# Altium schematic sheet RotationSensor.SchDoc
size Letter; CompanyName: Ploopy Corporation; Organization: Ploopy Corporation; Address1: Suite 226, 137-1140 Burnhamthorpe Road W; Address2: Mississauga; Address3: Ontario; Address4: Canada L5C 0A3; DocumentNumber: 7; Revision: R1.001; SheetNumber: 7; SheetTotal: 7
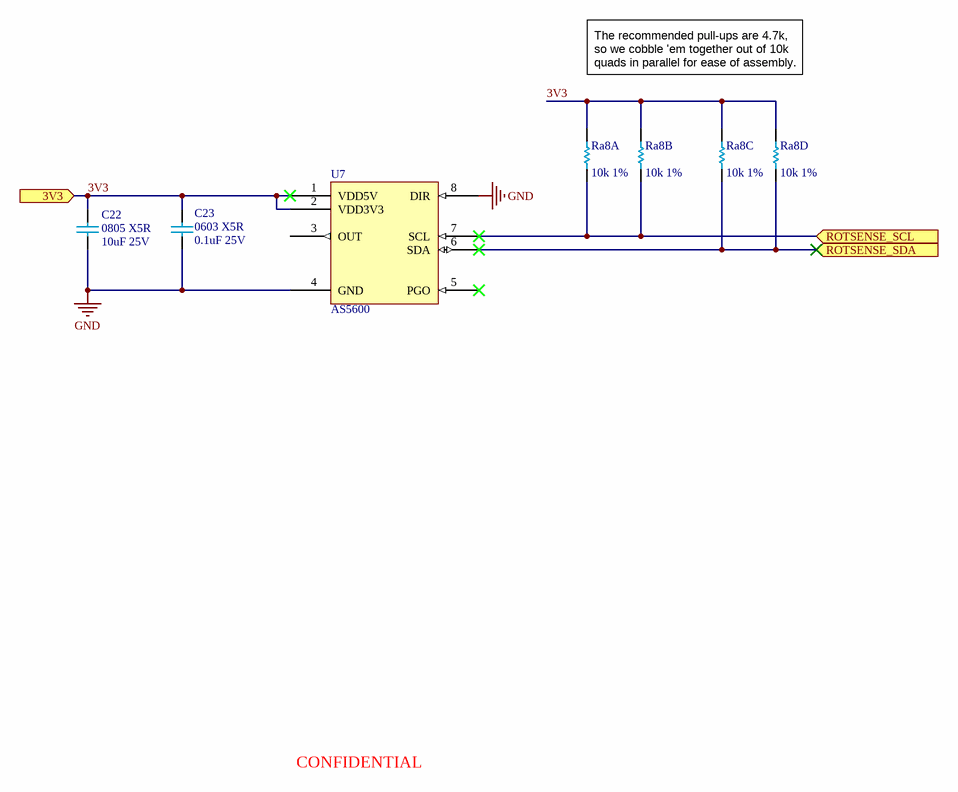
[diagram p0: RotationSensor.SchDoc]

## Parts
C22  0805 X5R  value 10uF 25V  [0805 - TALL]
C23  0603 X5R  value 0.1uF 25V  [0603 capacitor - CAPC1608X06N]
Ra8  value 10k 1%  [4x 10k 1% - CAC-80P320X160-8M]  (hidden comment: 1206 Quad)  (parts A,B,C,D of 4)
U7  AS5600  [AS5600]

## Ports
3V3 (in), ROTSENSE_SCL (in), ROTSENSE_SDA (in)

## Nets
GND: C22.1 C23.1 U7.4(GND) U7.8(DIR)
3V3: C22.2 C23.2 Ra8.5 Ra8.6 Ra8.7 Ra8.8 U7.1(VDD5V) U7.2(VDD3V3) ; port 3V3
ROTSENSE_SCL: Ra8.1 Ra8.2 U7.7(SCL) ; port ROTSENSE_SCL
ROTSENSE_SDA: Ra8.3 Ra8.4 U7.6(SDA) ; port ROTSENSE_SDA

Not connected (* = marked no-connect by the designer): U7 3(OUT) 5(PGO)*

## Notes on the sheet
- The recommended pull-ups are 4.7k, so we cobble 'em together out of 10k quads in parallel for ease of assembly.
- CONFIDENTIAL
- Copyright Ploopy Corporation 2024
- Licensed under the CERN-OHL-S v2
- http://ohwr.org/cernohl
- Title:
- PCB:
- Version:
- Ploopy Corporation
- Mississauga ON L5C 0A3
- 137-1140 Burnhamthorpe Road W
- Date:
- Time:
- Sheet
- of
- Canada

## Library data of the parts
C22 = Cap 10uF 25V: 0805, X5R or better; Supplier 1: Mouser; Supplier Part Number 1: 81-GRM21BR61E106KA3L; Supplier 2: Digi-Key; Supplier Part Number 2: 490-5523-1-ND
C23 = Cap 0.1uF 25V: 0603, X5R or better; Supplier 1: Digi-Key; Supplier Part Number 1: 1276-6840-2-ND
Ra8 = Quad Res 10k 1% 1206: Chip resistor
U7 = AS5600: Magnetic rotation sensor, PWM output; Supplier 1: Arrow; Supplier Part Number 1: JxJW4JDkv1L1ylkwpNJcAP-as8OSojp580yXT3MgaiM; Supplier 2: Digi-Key; Supplier Part Number 2: AS5600-ASOMCT-ND